# Altium project firesys.PrjPcb (part 1 of 2)
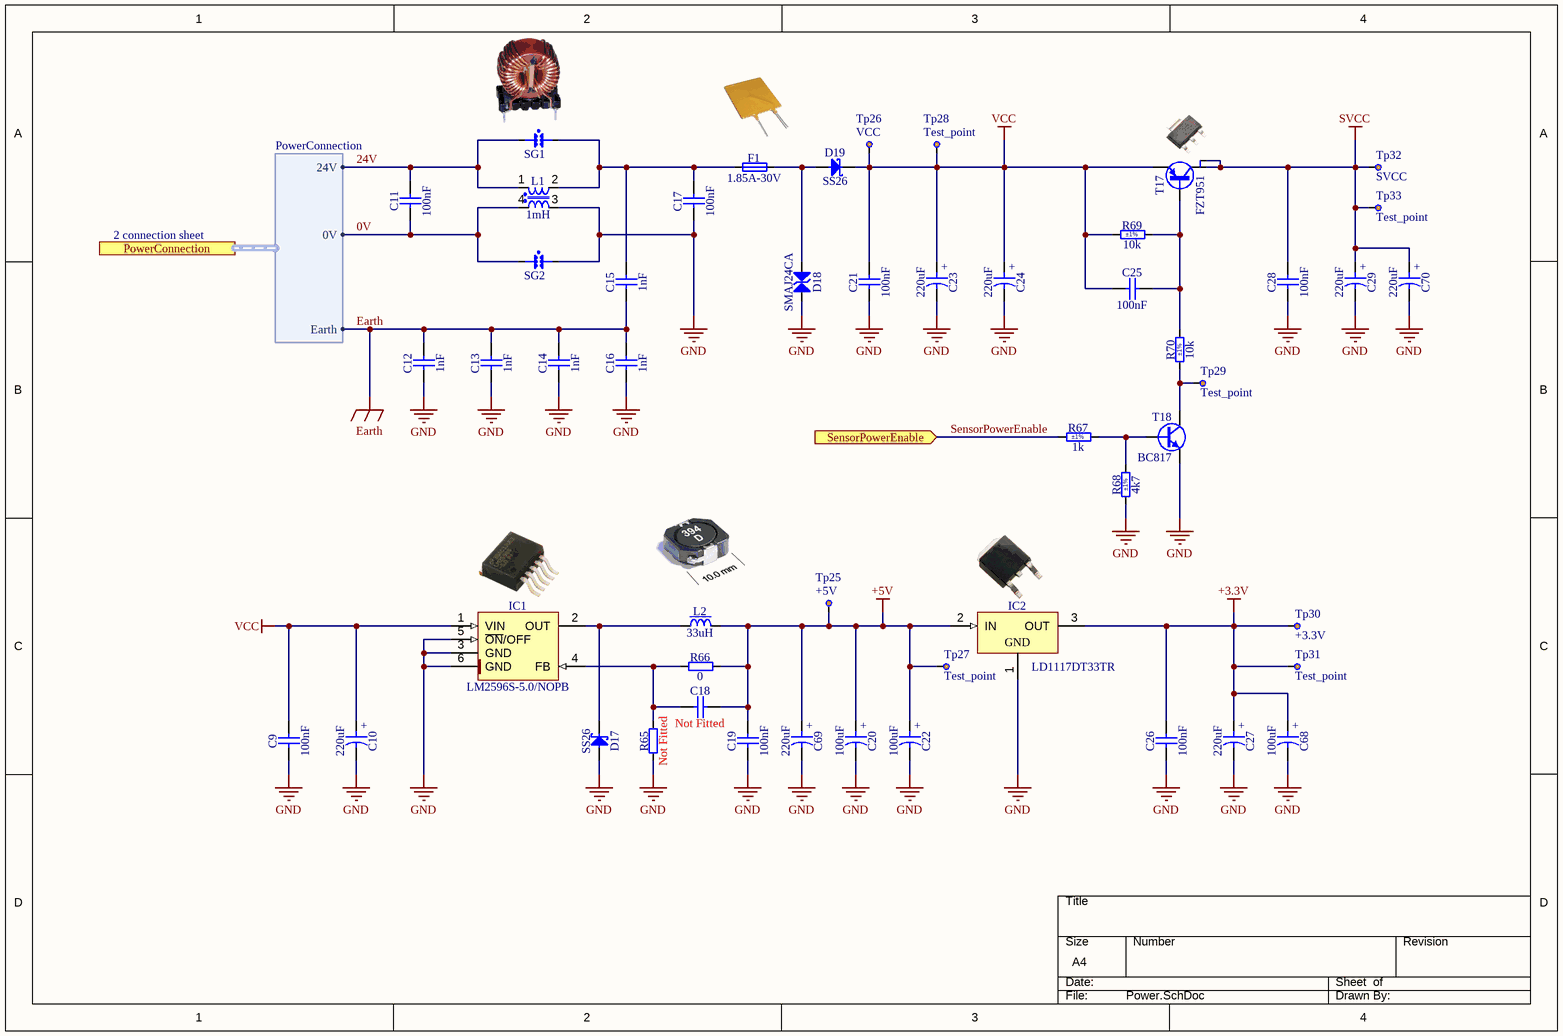
[diagram p0: Power.SchDoc]
10 sheets, 380 parts. Net scope: flat (ports and power ports of the same name join across sheets).
Board file: PCB1.PcbDoc
Sheets:
  Power.SchDoc
  Sensing.SchDoc
  FlashMemory.SchDoc
  mcu.SchDoc
  ShiftRegister.SchDoc
  Sound.SchDoc
  Interface.SchDoc
  Optocoupler.SchDoc
  Button.SchDoc
  Relay.SchDoc

## Sheet Power.SchDoc
size A4; SheetNumber: 2; SheetTotal: 11

### Parts
C9  100nF  [CAPC3216X140N]
C10  220uF  [CAPAE830X1020N]
C11  100nF  [CAPC3216X140N]
C12  1nF  [CAPC3216X94N]
C13  1nF  [CAPC3216X94N]
C14  1nF  [CAPC3216X94N]
C15  1nF  [CAPC3216X94N]
C16  1nF  [CAPC3216X94N]
C17  100nF  [CAPC3216X140N]
C18  Not Fitted  [CAPC2012X135N]
C19  100nF  [CAPC1608X87N]
C20  100uF  [CAPMP6032X280N]
C21  100nF  [CAPC3216X140N]
C22  100uF  [CAPMP6032X280N]
C23  220uF  [CAPAE830X1020N]
C24  220uF  [CAPAE830X1020N]
C25  100nF  [CAPC3216X140N]
C26  100nF  [CAPC1608X87N]
C27  220uF  [CAPAE830X1020N]
C28  100nF  [CAPC3216X140N]
C29  220uF  [CAPAE830X1020N]
C68  100uF  [CAPMP6032X280N]
C69  220uF  [CAPAE830X1020N]
C70  220uF  [CAPAE830X1020N]
D17  SS26  [DIOM5336X265N]
D18  SMAJ24CA  [DIOM5226X262N]
D19  SS26  [DIOM5336X265N]
F1  1.85A-30V  [FUSR_LITTELFUSE_RUEF185]
IC1  LM2596S-5.0/NOPB  [TO170P1435X465-6N-R1041X635]
IC2  LD1117DT33TR  [TO228P972X240-3N-R540X510]
L1  1mH  [IND_WURTH_WE-CMB-XS]
L2  33uH  [IND_COILCRAFT_MSS1038]
R65  Not Fitted  [RESC2012X60N]
R66  0  [RESC1608X55N]
R67  1k  Tolerance: ±1%  [RESC1608X55N]
R68  4k7  Tolerance: ±1%  [RESC1608X55N]
R69  10k  Tolerance: ±1%  [RESC3216X65N]
R70  10k  Tolerance: ±1%  [RESC3216X65N]
SG1  Spark Gap  [PCB_SPARK_GAP]  (value not drawn)
SG2  Spark Gap  [PCB_SPARK_GAP]  (value not drawn)
T17  FZT951  [SOT230P700X180-4N]
T18  BC817  [SOT95P230X110-3N]
Tp25  +5V  [TP_C40]
Tp26  VCC  [TP_C40]
Tp27  Test_point  [TP_C40]
Tp28  Test_point  [TP_C40]
Tp29  Test_point  [TP_C40]
Tp30  +3.3V  [TP_C40]
Tp31  Test_point  [TP_C40]
Tp32  SVCC  [TP_C40]
Tp33  Test_point  [TP_C40]

### Ports
PowerConnection (harness PowerConnection), SensorPowerEnable (in)

### Harnesses
PowerConnection: 24V, 0V, Earth

### Nets
+3.3V: C26.2 C27.1 C68.1 IC2.3(OUT) Tp30.1 Tp31.1
+5V: C18.2 C19.2 C20.1 C22.1 C69.1 IC2.2(IN) L2.2 R66.2 Tp25.1 Tp27.1
Earth: C12.2 C13.2 C14.2 C15.1 C16.2 ; port PowerConnection.Earth
GND: C9.1 C10.2 C12.1 C13.1 C14.1 C16.1 C17.1 C19.1 C20.2 C21.1 C22.2 C23.2 C24.2 C26.1 C27.2 C28.1 C29.2 C68.2 C69.2 C70.2 D17.2(A) D18.2 IC1.3(GND) IC1.5(~{ON}/OFF) IC1.6(GND) IC2.1(GND) L1.3 R65.1 R68.1 SG2.2 T18.2(E)
SVCC: C28.2 C29.1 C70.1 T17.2(C) T17.4(C) Tp32.1 Tp33.1
VCC: C9.2 C10.1 C21.2 C23.1 C24.1 C25.1 D19.1(C) IC1.1(VIN) R69.1 T17.3(E) Tp26.1 Tp28.1
0V: C11.1 L1.4 SG2.1 ; port PowerConnection.0V
24V: C11.2 L1.1 SG1.1 ; port PowerConnection.24V
SensorPowerEnable: R67.1 ; port SensorPowerEnable
NetC15_2: C15.2 C17.2 F1.1 L1.2 SG1.2
NetC18_1: C18.1 IC1.4(FB) R65.2 R66.1
NetC25_2: C25.2 R69.2 R70.2 T17.1(B)
NetD17_1: D17.1(C) IC1.2(OUT) L2.1
NetD18_1: D18.1 D19.2(A) F1.2
NetR67_2: R67.2 R68.2 T18.1(B)
NetR70_1: R70.1 T18.3(C) Tp29.1

### Notes on the sheet
- 2 connection sheet
- THIS DOCUMENT AND THE DATA DISCLOSED HEREIN OR
- HEREWITH IS THE PROPERTY OF ALTIUM LIMITED AND MAY
- DWG NO:
- REVISION
- REV:
- DESCRIPTION
- DATE
- APPROVED
- BE FREELY DISTRIBUTED IN WHOLE. NO RIGHTS ARE
- RESERVED OR EXPRESS OR IMPLIED WARANTEE GIVEN.
- ENG:
- APPROVALS
- PROJECT
- DSN:
- CHK:
- REFERENCE DOCUMENTS
- PROJECT REVISION:
- TITLE
- DOCUMENT REVISION:
- DESIGN ITEM:
- BOM:
- FAB DWG:
- PCB DWG:
- ASSY DWG:
- SCALE:
- A3
- SIZE
- CAGE CODE
- FILE NAME
- DWG NO.
- SHEET
- OF
- REV
- (in symbol CAE830-1020_220UF_50V_20%) +
- (in symbol CTE6032-28_100UF_16V_10%) +

### Library data of the parts
C9 C11 C17 C21 C25 C28 = CC1206_100NF_100V_10%_X7R: Non-polarised capacitor; Part Description: SMD Multilayer Chip Ceramic Capacitor; Manufacturer: GENERIC; Manufacturer1 Part Number: 222260115649; Voltage: 100V; TC: X7R; Tolerance: ±10%; Part Number: CC1206_100NF_100V_10%_X7R; Component Kind: Standard; Component Type: Standard; Pin Count: 2; Value: 100nF; Status: Preferred; Manufacturer Part Number: CC1206_100NF_100V_10%_X7R; Case: 1206; Mounted: Yes; Socket: No; SMD: Yes; Sense: No; Manufacturer1 Example: PHYCOMP; Manufacturer1 ComponentHeight: 1.25mm; HelpURL: \\cern.ch\dfs\Applications\Altium\Datasheets\CC1206_X7R_PHYCOMP.pdf; Author: CERN DEM JLC; CreateDate: 24.08.2009; LatestRevisionDate: 24.08.2009
C10 C23 C24 C27 C29 C69 C70 = CAE830-1020_220UF_50V_20%: Polarised capacitor; Part Description: Aluminum Electrolytic SMT Capacitor; Manufacturer: PANASONIC; Manufacturer Part Number: EEEFT1H221AP; Voltage: 50V; Tolerance: ±20%; Part Number: CAE830-1020_220UF_50V_20%; Component Kind: Standard; Component Type: Standard; Pin Count: 2; Value: 220uF; Status: Not Recommended; Case: F; Mounted: Yes; Socket: No; SMD: Yes; Sense: No; ComponentHeight: 10.2mm; HelpURL: \\cern.ch\dfs\Applications\Altium\Datasheets\CAE_PANASONIC_FT.pdf; Author: CERN DEM BC; CreateDate: 12.04.2021; LatestRevisionDate: 12.04.2021
C12-C16 = CC1206_1NF_200V_10%_X7R: Non-polarised capacitor; Part Description: SMD Multilayer Chip Ceramic Capacitor; Manufacturer: GENERIC; Manufacturer1 Part Number: 12062C102KAT2A; Voltage: 200V; TC: X7R; Tolerance: ±10%; Part Number: CC1206_1NF_200V_10%_X7R; Component Kind: Standard; Component Type: Standard; Pin Count: 2; Value: 1nF; Status: None; Manufacturer Part Number: CC1206_1NF_200V_10%_X7R; Case: 1206; Mounted: Yes; Socket: No; SMD: Yes; Sense: No; Manufacturer1 Example: AVX; Manufacturer1 ComponentHeight: 0.94mm; HelpURL: \\cern.ch\dfs\Applications\Altium\Datasheets\CC1206_X7R_AVX.pdf; Author: CERN DEM JLC; CreateDate: 05.03.2015; LatestRevisionDate: 05.03.2015
C18 = CC0805_NO-VALUE: Non-polarised capacitor; Part Description: Reserved Footprint For 0805(2012) Chip Ceramic Capacitor; Value: Undefined; Mounted: No; Part Number: CC0805_NO-VALUE; Component Kind: Standard; Component Type: Standard; Pin Count: 2; Status: None; Manufacturer: Undefined; Manufacturer Part Number: CC0805_NO-VALUE; Case: 0805; Socket: No; SMD: Yes; Sense: No; Manufacturer1 ComponentHeight: 1.35mm; HelpURL: Undefined; Author: CERN DEM JLC; CreateDate: 10.12.2008; LatestRevisionDate: 11.09.2013
C19 C26 = CC0603_100NF_50V_10%_X7R: Non-polarised capacitor; Part Description: SMD Multilayer Chip Ceramic Capacitor; Manufacturer: GENERIC; Manufacturer1 Part Number: 223858615649; Voltage: 50V; TC: X7R; Tolerance: ±10%; Part Number: CC0603_100NF_50V_10%_X7R; Component Kind: Standard; Component Type: Standard; Pin Count: 2; Value: 100nF; Status: Preferred; Manufacturer Part Number: CC0603_100NF_50V_10%_X7R; Case: 0603; Mounted: Yes; Socket: No; SMD: Yes; Sense: No; Manufacturer1 Example: PHYCOMP; Manufacturer1 ComponentHeight: 0.87mm; HelpURL: \\cern.ch\dfs\Applications\Altium\Datasheets\CC0603_X7R_PHYCOMP.pdf; Author: CERN DEM JLC; CreateDate: 03.12.2007; LatestRevisionDate: 03.12.2007
C20 C22 C68 = CTE6032-28_100UF_16V_10%: Polarised capacitor; Part Description: Solid Tantalum Chip Capacitor; Manufacturer: GENERIC; Manufacturer1 Part Number: TAJC107K016RNJ; Voltage: 16V; Tolerance: ±10%; Part Number: CTE6032-28_100UF_16V_10%; Component Kind: Standard; Component Type: Standard; Pin Count: 2; Value: 100uF; Status: Preferred; Manufacturer Part Number: CTE6032-28_100UF_16V_10%; Case: C; Mounted: Yes; Socket: No; SMD: Yes; Sense: No; Manufacturer1 Example: AVX; Manufacturer1 ComponentHeight: 2.8mm; HelpURL: \\cern.ch\dfs\Applications\Altium\Datasheets\CTE_AVX_TAJ.pdf; Author: CERN DEM JLC; CreateDate: 16.12.2013; LatestRevisionDate: 14.04.2021
D17 D19 = SS26: Schottky Diode; Part Description: Schottky Rectifier; Manufacturer: FAIRCHILD SEMICONDUCTOR; Voltage: 60V; Power: 2A; PressFit: No; Bonding: No; Part Number: SS26; Component Kind: Standard; Component Type: Standard; Device: SS26; PackageDescription: DO-214-AA/SMB Diode, Molded Body; 5.34mm L X 3.625mm W X 2.65mm H, IPC Medium Density; Manufacturer Part Number: SS26; Pin Count: 2; Case: DO-214AA; Mounted: Yes; Socket: No; SMD: Yes; Sense: No; ComponentHeight: 2.65mm; HelpURL: \\cern.ch\dfs\Applications\Altium\Datasheets\SS26.pdf; Author: CERN DEM JMW; CreateDate: 10.07.2015; LatestRevisionDate: 10.07.2015
D18 = SMAJ24CA: Transient Voltage Suppressor Diode (Bi-Directional); Part Description: Surface Mount Bi-directional Transient Voltage Suppressor Diode; Manufacturer: BOURNS; Voltage: 24V; Power: 400W; PressFit: No; Bonding: No; Part Number: SMAJ24CA; Component Kind: Standard; Component Type: Standard; Device: SMAJ24CA; PackageDescription: DO-214-AC/SMA Diode, Molded Body; 5.21mm L X 2.605mm W X 2.62mm H, IPC Medium Density; Manufacturer Part Number: SMAJ24CA; Pin Count: 2; Case: DO-214AC; Mounted: Yes; Socket: No; SMD: Yes; Sense: No; ComponentHeight: 2.62mm; HelpURL: \\cern.ch\dfs\Applications\Altium\Datasheets\SMAJ24CA.pdf; Author: CERN DEM JLC; CreateDate: 06.07.2011; LatestRevisionDate: 06.07.2011
F1 = FUSR_LITTELFUSE_RUEF185: Fuse; Part Description: Radial-Leaded PolySwitch® PPTC Resettable Fuse; PressFit: No; Part Number: FUSR_LITTELFUSE_RUEF185; Component Kind: Standard; Component Type: Standard; Pin Count: 2; PackageDescription: Radial-Leaded PolySwitch® PPTC Resettable Fuse, Body 10.2 x 3.00mm, RUEF Series; Family: Fuses Resettable; Mounted: Yes; Socket: No; SMD: No; Sense: No; Value: 1.85A-30V; Manufacturer: LITTELFUSE; Manufacturer Part Number: RUEF185; ComponentHeight: 15.7mm; HelpURL: \\cern.ch\dfs\Applications\Altium\Datasheets\FUSR_LITTELFUSE_RUEF.pdf; Author: CERN DEM BC; CreateDate: 09.04.2021; LatestRevisionDate: 09.04.2021
IC1 = LM2596S-5.0/NOPB: SIMPLE SWITCHER® Power Converter 150kHz, 3A Step-Down Voltage Regulator; Part Description: 4.5V to 40V Input to 5V Output, SIMPLE SWITCHER® Power Converter 150kHz, 3A Step-Down Voltage Regulator; Manufacturer: TEXAS INSTRUMENTS; PressFit: No; Bonding: No; Part Number: LM2596S-5.0/NOPB; Component Kind: Standard; Component Type: Standard; Device: LM2596S-5.0/NOPB; PackageDescription: D2PAK TO-263, TO, 1.70mm Pitch; 5 Pin, 14.35mm L X 8.64mm W X 4.65mm H body IPC Medium Density; Manufacturer Part Number: LM2596S-5.0/NOPB; Pin Count: 6; Case: TO-263-5; Mounted: Yes; Socket: No; SMD: Yes; Sense: No; ComponentHeight: 4.65mm; HelpURL: \\cern.ch\dfs\Applications\Altium\Datasheets\LM2596S-5.0-NOPB.pdf; Author: CERN DEM JLC; CreateDate: 19.12.2018; LatestRevisionDate: 19.12.2018
IC2 = LD1117DT33TR: 3-Terminal Regulator 1=GND 2=IN 3=OUT; Part Description: 3.3V 800mA Low drop fixed and adjustable positive voltage regulators; Manufacturer: ST MICROELECTRONICS; PressFit: No; Bonding: No; Part Number: LD1117DT33TR; Component Kind: Standard; Component Type: Standard; Device: LD1117DT33TR; PackageDescription: TO-252 DPAK TO, 2.28mm Pitch; 2 Pin, 9.725mm L X 6.10mm W X 2.40mm H body, IPC Medium Density; Manufacturer Part Number: LD1117DT33TR; Pin Count: 3; Case: DPAK; Mounted: Yes; Socket: No; SMD: Yes; Sense: No; ComponentHeight: 2.4mm; HelpURL: \\cern.ch\dfs\Applications\Altium\Datasheets\LD1117DT33TR.pdf; Author: CERN DEM JLC; CreateDate: 02.09.2009; LatestRevisionDate: 21.09.2009
L1 = IND_1MH_30%_WURTH_WE-CMB-XS: Inductor Common Mode; Part Description: Common Mode Power Choke WE-CMB Series Type XS; Manufacturer: WURTH ELEKTRONIK; Manufacturer Part Number: 744821201; Power: 2A; Resistance: 0.045R; Tolerance: ±30%; Part Number: IND_1MH_30%_WURTH_WE-CMB-XS; Component Kind: Standard; Component Type: Standard; Pin Count: 4; Value: 1mH; Mounted: Yes; Socket: No; SMD: No; Sense: No; ComponentHeight: 18mm; HelpURL: \\cern.ch\dfs\Applications\Altium\Datasheets\IND_WURTH_WE-CMB_744821201.pdf; Author: CERN DEM JLC; CreateDate: 03.09.2012; LatestRevisionDate: 03.09.2012
L2 = IND_33UH_20%_COILCRAFT_MSS1038: Inductor With Core; Part Description: SMT Power Inductor; Manufacturer Part Number: MSS1038-333ML; Power: 1.6A; Resistance: 0.093R; Tolerance: ±20%; Part Number: IND_33UH_20%_COILCRAFT_MSS1038; Component Kind: Standard; Component Type: Standard; Pin Count: 2; Value: 33uH; Manufacturer: COILCRAFT; Mounted: Yes; Socket: No; SMD: Yes; Sense: No; ComponentHeight: 4.0mm; HelpURL: \\cern.ch\dfs\Applications\Altium\Datasheets\IND_COILCRAFT_MSS1038.pdf; Author: CERN DEM JLC; CreateDate: 09.12.2009; LatestRevisionDate: 09.12.2009
R65 = R0805_NO-VALUE: Resistor; Part Description: Reserved Footprint For a 0805 (2012) Chip Resistor; Value: Undefined; PressFit: No; Mounted: No; Part Number: R0805_NO-VALUE; Component Kind: Standard; Component Type: Standard; Pin Count: 2; Status: None; Manufacturer: Undefined; Manufacturer Part Number: R0805_NO-VALUE; Case: 0805; Sense: No; Socket: No; SMD: Yes; Manufacturer1 Example: Undefined; Manufacturer1 Part Number: Undefined; Manufacturer1 ComponentHeight: Undefined; HelpURL: Undefined; Author: CERN DEM JLC; CreateDate: 03.12.2007; LatestRevisionDate: 13.03.2008
R66 = R0603_0R_JUMPER: Resistor; Part Description: 1A (0.05R Max DC Resistance) Zero Ohm Jumper; Manufacturer: GENERIC; Manufacturer1 Part Number: NRC06Z0; PressFit: No; Part Number: R0603_0R_JUMPER; Component Kind: Standard; Component Type: Standard; Pin Count: 2; Value: 0; Status: Preferred; Manufacturer Part Number: R0603_0R_JUMPER; Case: 0603; Mounted: Yes; Sense: No; Socket: No; SMD: Yes; Manufacturer1 Example: NIC COMPONENT; Manufacturer1 ComponentHeight: 0.55mm; HelpURL: \\cern.ch\dfs\Applications\Altium\Datasheets\R0603_NIC_NRC.pdf; Author: CERN DEM JLC; CreateDate: 03.12.2007; LatestRevisionDate: 13.03.2008
R67 = R0603_1K_1%_0.1W_100PPM: Resistor - 1%; Part Description: General Purpose Thick Film Chip Resistor; Manufacturer: GENERIC; Manufacturer1 Part Number: NRC06F1001TRF; Power: 0.1W; TC: ±100ppm/°C; PressFit: No; Part Number: R0603_1K_1%_0.1W_100PPM; Component Kind: Standard; Component Type: Standard; Pin Count: 2; Value: 1k; Status: Preferred; Manufacturer Part Number: R0603_1K_1%_0.1W_100PPM; Case: 0603; Mounted: Yes; Sense: No; Socket: No; SMD: Yes; Manufacturer1 Example: NIC COMPONENT; Manufacturer1 ComponentHeight: 0.55mm; HelpURL: \\cern.ch\dfs\Applications\Altium\Datasheets\R0603_NIC_NRC.pdf; Author: CERN DEM JLC; CreateDate: 03.12.2007; LatestRevisionDate: 13.03.2008
R68 = R0603_4K7_1%_0.1W_100PPM: Resistor - 1%; Part Description: General Purpose Thick Film Chip Resistor; Manufacturer: GENERIC; Manufacturer1 Part Number: NRC06F4701TRF; Power: 0.1W; TC: ±100ppm/°C; PressFit: No; Part Number: R0603_4K7_1%_0.1W_100PPM; Component Kind: Standard; Component Type: Standard; Pin Count: 2; Value: 4k7; Status: Preferred; Manufacturer Part Number: R0603_4K7_1%_0.1W_100PPM; Case: 0603; Mounted: Yes; Sense: No; Socket: No; SMD: Yes; Manufacturer1 Example: NIC COMPONENT; Manufacturer1 ComponentHeight: 0.55mm; HelpURL: \\cern.ch\dfs\Applications\Altium\Datasheets\R0603_NIC_NRC.pdf; Author: CERN DEM JLC; CreateDate: 03.12.2007; LatestRevisionDate: 13.03.2008
R69 R70 = R1206_10K_1%_0.25W_100PPM: Resistor - 1%; Part Description: General Purpose Thick Film Chip Resistor; Manufacturer: GENERIC; Manufacturer1 Part Number: NRC12F1002TRF; Power: 0.25W; TC: ±100ppm/°C; PressFit: No; Part Number: R1206_10K_1%_0.25W_100PPM; Component Kind: Standard; Component Type: Standard; Pin Count: 2; Value: 10k; Status: Preferred; Manufacturer Part Number: R1206_10K_1%_0.25W_100PPM; Case: 1206; Mounted: Yes; Sense: No; Socket: No; SMD: Yes; Manufacturer1 Example: NIC COMPONENT; Manufacturer1 ComponentHeight: 0.65mm; HelpURL: \\cern.ch\dfs\Applications\Altium\Datasheets\R1206_NIC_NRC.pdf; Author: CERN DEM JLC; CreateDate: 03.12.2007; LatestRevisionDate: 13.03.2008
SG1 SG2 = SparkGap: PCB Spark Gap
T17 = FZT951: PNP Transistor; Part Description: 60V 5A PNP Silicon Planar High Current Transistor; Manufacturer: ZETEX SEMICONDUCTORS; PressFit: No; Bonding: No; Part Number: FZT951; Component Kind: Standard; Component Type: Standard; Device: FZT951; PackageDescription: SOT223, 2.30mm Pitch; 4 Pin, 3.70mm W X 6.70mm L X 1.80mm H body, IPC Medium Density; Manufacturer Part Number: FZT951; Pin Count: 4; Case: SOT223; Mounted: Yes; Socket: No; SMD: Yes; Sense: No; ComponentHeight: 1.8mm; HelpURL: \\cern.ch\dfs\Applications\Altium\Datasheets\FZT951.pdf; Author: CERN DEM JLC; CreateDate: 16.07.2008; LatestRevisionDate: 16.07.2008
T18 = BC817: NPN Transistor; Part Description: 45V 500mA NPN General-Purpose Transistor; Manufacturer: NXP SEMICONDUCTORS; PressFit: No; Bonding: No; Part Number: BC817; Component Kind: Standard; Component Type: Standard; Device: BC817; PackageDescription: SOT23, 0.95mm Pitch; 3 Pin, 1.30mm W X 2.90mm L X 1.10mm H body, IPC Medium Density; Manufacturer Part Number: BC817; Pin Count: 3; Case: SOT23-3; Mounted: Yes; Socket: No; SMD: Yes; Sense: No; ComponentHeight: 1.1mm; HelpURL: \\cern.ch\dfs\Applications\Altium\Datasheets\BC817.pdf; Author: CERN DEM JLC; CreateDate: 12.05.2011; LatestRevisionDate: 12.05.2011
Tp25-Tp33 = Test point: Published: 8-Jun-2000; LatestRevisionDate: 17-Jul-2002; LatestRevisionNote: Re-released for DXP Platform.; PackageReference: AXIAL-0.3; Publisher: Altium Limited

## Sheet Sensing.SchDoc
size A3; SheetNumber: 3; SheetTotal: 11
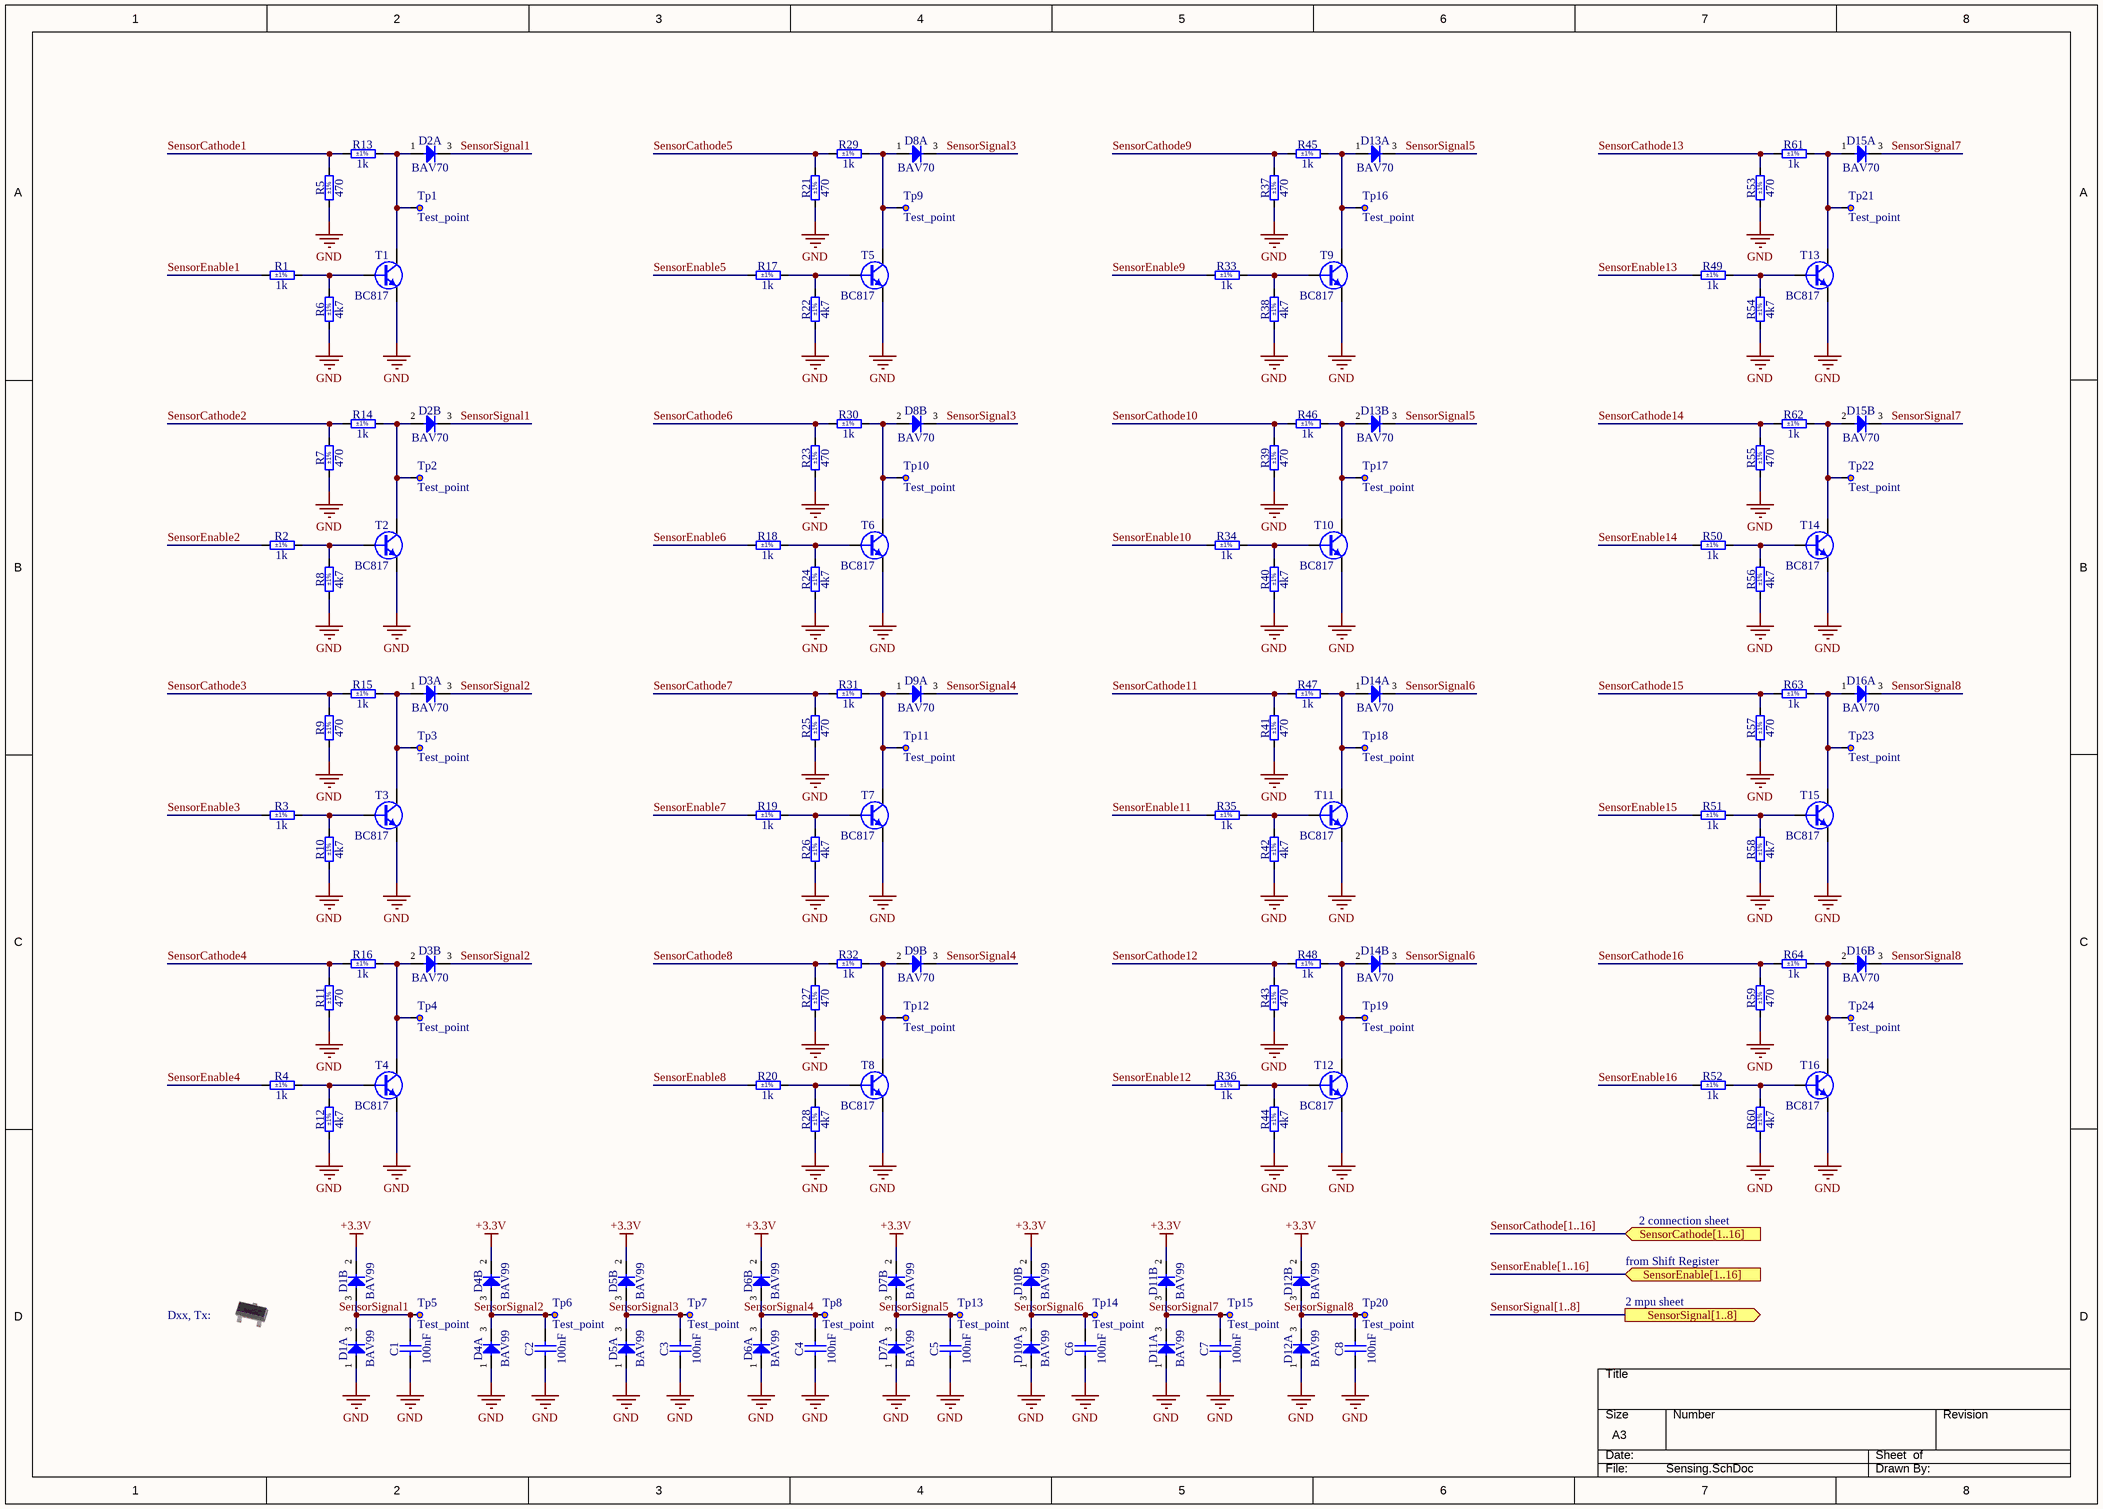
[diagram p1: Sensing.SchDoc]

### Parts
C1  100nF  [CAPC1608X87N]
C2  100nF  [CAPC1608X87N]
C3  100nF  [CAPC1608X87N]
C4  100nF  [CAPC1608X87N]
C5  100nF  [CAPC1608X87N]
C6  100nF  [CAPC1608X87N]
C7  100nF  [CAPC1608X87N]
C8  100nF  [CAPC1608X87N]
D1  BAV99  [SOT95P240X110-3N]  (parts A,B of 2)
D2  BAV70  [SOT95P240X110-3N]  (parts A,B of 2)
D3  BAV70  [SOT95P240X110-3N]  (parts A,B of 2)
D4  BAV99  [SOT95P240X110-3N]  (parts A,B of 2)
D5  BAV99  [SOT95P240X110-3N]  (parts A,B of 2)
D6  BAV99  [SOT95P240X110-3N]  (parts A,B of 2)
D7  BAV99  [SOT95P240X110-3N]  (parts A,B of 2)
D8  BAV70  [SOT95P240X110-3N]  (parts A,B of 2)
D9  BAV70  [SOT95P240X110-3N]  (parts A,B of 2)
D10  BAV99  [SOT95P240X110-3N]  (parts A,B of 2)
D11  BAV99  [SOT95P240X110-3N]  (parts A,B of 2)
D12  BAV99  [SOT95P240X110-3N]  (parts A,B of 2)
D13  BAV70  [SOT95P240X110-3N]  (parts A,B of 2)
D14  BAV70  [SOT95P240X110-3N]  (parts A,B of 2)
D15  BAV70  [SOT95P240X110-3N]  (parts A,B of 2)
D16  BAV70  [SOT95P240X110-3N]  (parts A,B of 2)
R1  1k  Tolerance: ±1%  [RESC1608X55N]
R2  1k  Tolerance: ±1%  [RESC1608X55N]
R3  1k  Tolerance: ±1%  [RESC1608X55N]
R4  1k  Tolerance: ±1%  [RESC1608X55N]
R5  470  Tolerance: ±1%  [RESC6331X70N]
R6  4k7  Tolerance: ±1%  [RESC1608X55N]
R7  470  Tolerance: ±1%  [RESC6331X70N]
R8  4k7  Tolerance: ±1%  [RESC1608X55N]
R9  470  Tolerance: ±1%  [RESC6331X70N]
R10  4k7  Tolerance: ±1%  [RESC1608X55N]
R11  470  Tolerance: ±1%  [RESC6331X70N]
R12  4k7  Tolerance: ±1%  [RESC1608X55N]
R13  1k  Tolerance: ±1%  [RESC1608X55N]
R14  1k  Tolerance: ±1%  [RESC1608X55N]
R15  1k  Tolerance: ±1%  [RESC1608X55N]
R16  1k  Tolerance: ±1%  [RESC1608X55N]
R17  1k  Tolerance: ±1%  [RESC1608X55N]
R18  1k  Tolerance: ±1%  [RESC1608X55N]
R19  1k  Tolerance: ±1%  [RESC1608X55N]
R20  1k  Tolerance: ±1%  [RESC1608X55N]
R21  470  Tolerance: ±1%  [RESC6331X70N]
R22  4k7  Tolerance: ±1%  [RESC1608X55N]
R23  470  Tolerance: ±1%  [RESC6331X70N]
R24  4k7  Tolerance: ±1%  [RESC1608X55N]
R25  470  Tolerance: ±1%  [RESC6331X70N]
R26  4k7  Tolerance: ±1%  [RESC1608X55N]
R27  470  Tolerance: ±1%  [RESC6331X70N]
R28  4k7  Tolerance: ±1%  [RESC1608X55N]
R29  1k  Tolerance: ±1%  [RESC1608X55N]
R30  1k  Tolerance: ±1%  [RESC1608X55N]
R31  1k  Tolerance: ±1%  [RESC1608X55N]
R32  1k  Tolerance: ±1%  [RESC1608X55N]
R33  1k  Tolerance: ±1%  [RESC1608X55N]
R34  1k  Tolerance: ±1%  [RESC1608X55N]
R35  1k  Tolerance: ±1%  [RESC1608X55N]
R36  1k  Tolerance: ±1%  [RESC1608X55N]
R37  470  Tolerance: ±1%  [RESC6331X70N]
R38  4k7  Tolerance: ±1%  [RESC1608X55N]
R39  470  Tolerance: ±1%  [RESC6331X70N]
R40  4k7  Tolerance: ±1%  [RESC1608X55N]
R41  470  Tolerance: ±1%  [RESC6331X70N]
R42  4k7  Tolerance: ±1%  [RESC1608X55N]
R43  470  Tolerance: ±1%  [RESC6331X70N]
R44  4k7  Tolerance: ±1%  [RESC1608X55N]
R45  1k  Tolerance: ±1%  [RESC1608X55N]
R46  1k  Tolerance: ±1%  [RESC1608X55N]
R47  1k  Tolerance: ±1%  [RESC1608X55N]
R48  1k  Tolerance: ±1%  [RESC1608X55N]
R49  1k  Tolerance: ±1%  [RESC1608X55N]
R50  1k  Tolerance: ±1%  [RESC1608X55N]
R51  1k  Tolerance: ±1%  [RESC1608X55N]
R52  1k  Tolerance: ±1%  [RESC1608X55N]
R53  470  Tolerance: ±1%  [RESC6331X70N]
R54  4k7  Tolerance: ±1%  [RESC1608X55N]
R55  470  Tolerance: ±1%  [RESC6331X70N]
R56  4k7  Tolerance: ±1%  [RESC1608X55N]
R57  470  Tolerance: ±1%  [RESC6331X70N]
R58  4k7  Tolerance: ±1%  [RESC1608X55N]
R59  470  Tolerance: ±1%  [RESC6331X70N]
R60  4k7  Tolerance: ±1%  [RESC1608X55N]
R61  1k  Tolerance: ±1%  [RESC1608X55N]
R62  1k  Tolerance: ±1%  [RESC1608X55N]
R63  1k  Tolerance: ±1%  [RESC1608X55N]
R64  1k  Tolerance: ±1%  [RESC1608X55N]
T1  BC817  [SOT95P230X110-3N]
T2  BC817  [SOT95P230X110-3N]
T3  BC817  [SOT95P230X110-3N]
T4  BC817  [SOT95P230X110-3N]
T5  BC817  [SOT95P230X110-3N]
T6  BC817  [SOT95P230X110-3N]
T7  BC817  [SOT95P230X110-3N]
T8  BC817  [SOT95P230X110-3N]
T9  BC817  [SOT95P230X110-3N]
T10  BC817  [SOT95P230X110-3N]
T11  BC817  [SOT95P230X110-3N]
T12  BC817  [SOT95P230X110-3N]
T13  BC817  [SOT95P230X110-3N]
T14  BC817  [SOT95P230X110-3N]
T15  BC817  [SOT95P230X110-3N]
T16  BC817  [SOT95P230X110-3N]
Tp1  Test_point  [TP_C40]
Tp2  Test_point  [TP_C40]
Tp3  Test_point  [TP_C40]
Tp4  Test_point  [TP_C40]
Tp5  Test_point  [TP_C40]
Tp6  Test_point  [TP_C40]
Tp7  Test_point  [TP_C40]
Tp8  Test_point  [TP_C40]
Tp9  Test_point  [TP_C40]
Tp10  Test_point  [TP_C40]
Tp11  Test_point  [TP_C40]
Tp12  Test_point  [TP_C40]
Tp13  Test_point  [TP_C40]
Tp14  Test_point  [TP_C40]
Tp15  Test_point  [TP_C40]
Tp16  Test_point  [TP_C40]
Tp17  Test_point  [TP_C40]
Tp18  Test_point  [TP_C40]
Tp19  Test_point  [TP_C40]
Tp20  Test_point  [TP_C40]
Tp21  Test_point  [TP_C40]
Tp22  Test_point  [TP_C40]
Tp23  Test_point  [TP_C40]
Tp24  Test_point  [TP_C40]

### Ports
SensorCathode[1..16] (in), SensorEnable[1..16] (in), SensorSignal[1..8] (out)

### Nets
+3.3V: D1.2(C) D4.2(C) D5.2(C) D6.2(C) D7.2(C) D10.2(C) D11.2(C) D12.2(C)
GND: C1.1 C2.1 C3.1 C4.1 C5.1 C6.1 C7.1 C8.1 D1.1(A) D4.1(A) D5.1(A) D6.1(A) D7.1(A) D10.1(A) D11.1(A) D12.1(A) R5.1 R6.1 R7.1 R8.1 R9.1 R10.1 R11.1 R12.1 R21.1 R22.1 R23.1 R24.1 R25.1 R26.1 R27.1 R28.1 R37.1 R38.1 R39.1 R40.1 R41.1 R42.1 R43.1 R44.1 R53.1 R54.1 R55.1 R56.1 R57.1 R58.1 R59.1 R60.1 T1.2(E) T2.2(E) T3.2(E) T4.2(E) T5.2(E) T6.2(E) T7.2(E) T8.2(E) T9.2(E) T10.2(E) T11.2(E) T12.2(E) T13.2(E) T14.2(E) T15.2(E) T16.2(E)
SensorCathode1: R5.2 R13.1
SensorCathode2: R7.2 R14.1
SensorCathode3: R9.2 R15.1
SensorCathode4: R11.2 R16.1
SensorCathode5: R21.2 R29.1
SensorCathode6: R23.2 R30.1
SensorCathode7: R25.2 R31.1
SensorCathode8: R27.2 R32.1
SensorCathode9: R37.2 R45.1
SensorCathode10: R39.2 R46.1
SensorCathode11: R41.2 R47.1
SensorCathode12: R43.2 R48.1
SensorCathode13: R53.2 R61.1
SensorCathode14: R55.2 R62.1
SensorCathode15: R57.2 R63.1
SensorCathode16: R59.2 R64.1
SensorEnable1: R1.1
SensorEnable2: R2.1
SensorEnable3: R3.1
SensorEnable4: R4.1
SensorEnable5: R17.1
SensorEnable6: R18.1
SensorEnable7: R19.1
SensorEnable8: R20.1
SensorEnable9: R33.1
SensorEnable10: R34.1
SensorEnable11: R35.1
SensorEnable12: R36.1
SensorEnable13: R49.1
SensorEnable14: R50.1
SensorEnable15: R51.1
SensorEnable16: R52.1
SensorSignal1: C1.2 D1.3(COMAC) D2.3(COMC) Tp5.1
SensorSignal2: C2.2 D3.3(COMC) D4.3(COMAC) Tp6.1
SensorSignal3: C3.2 D5.3(COMAC) D8.3(COMC) Tp7.1
SensorSignal4: C4.2 D6.3(COMAC) D9.3(COMC) Tp8.1
SensorSignal5: C5.2 D7.3(COMAC) D13.3(COMC) Tp13.1
SensorSignal6: C6.2 D10.3(COMAC) D14.3(COMC) Tp14.1
SensorSignal7: C7.2 D11.3(COMAC) D15.3(COMC) Tp15.1
SensorSignal8: C8.2 D12.3(COMAC) D16.3(COMC) Tp20.1
NetD2_1: D2.1(A) R13.2 T1.3(C) Tp1.1
NetD2_2: D2.2(A) R14.2 T2.3(C) Tp2.1
NetD3_1: D3.1(A) R15.2 T3.3(C) Tp3.1
NetD3_2: D3.2(A) R16.2 T4.3(C) Tp4.1
NetD8_1: D8.1(A) R29.2 T5.3(C) Tp9.1
NetD8_2: D8.2(A) R30.2 T6.3(C) Tp10.1
NetD9_1: D9.1(A) R31.2 T7.3(C) Tp11.1
NetD9_2: D9.2(A) R32.2 T8.3(C) Tp12.1
NetD13_1: D13.1(A) R45.2 T9.3(C) Tp16.1
NetD13_2: D13.2(A) R46.2 T10.3(C) Tp17.1
NetD14_1: D14.1(A) R47.2 T11.3(C) Tp18.1
NetD14_2: D14.2(A) R48.2 T12.3(C) Tp19.1
NetD15_1: D15.1(A) R61.2 T13.3(C) Tp21.1
NetD15_2: D15.2(A) R62.2 T14.3(C) Tp22.1
NetD16_1: D16.1(A) R63.2 T15.3(C) Tp23.1
NetD16_2: D16.2(A) R64.2 T16.3(C) Tp24.1
NetR1_2: R1.2 R6.2 T1.1(B)
NetR2_2: R2.2 R8.2 T2.1(B)
NetR3_2: R3.2 R10.2 T3.1(B)
NetR4_2: R4.2 R12.2 T4.1(B)
NetR17_2: R17.2 R22.2 T5.1(B)
NetR18_2: R18.2 R24.2 T6.1(B)
NetR19_2: R19.2 R26.2 T7.1(B)
NetR20_2: R20.2 R28.2 T8.1(B)
NetR33_2: R33.2 R38.2 T9.1(B)
NetR34_2: R34.2 R40.2 T10.1(B)
NetR35_2: R35.2 R42.2 T11.1(B)
NetR36_2: R36.2 R44.2 T12.1(B)
NetR49_2: R49.2 R54.2 T13.1(B)
NetR50_2: R50.2 R56.2 T14.1(B)
NetR51_2: R51.2 R58.2 T15.1(B)
NetR52_2: R52.2 R60.2 T16.1(B)

### Buses and harness runs
bus SensorCathode[1..16] = port SensorCathode[1..16]
bus SensorEnable[1..16] = port SensorEnable[1..16]
bus SensorSignal[1..8] = port SensorSignal[1..8]

### Notes on the sheet
- from Shift Register
- 2 connection sheet
- Dxx, Tx:
- 2 mpu sheet
- THIS DOCUMENT AND THE DATA DISCLOSED HEREIN OR
- HEREWITH IS THE PROPERTY OF ALTIUM LIMITED AND MAY
- DWG NO:
- REVISION
- REV:
- DESCRIPTION
- DATE
- APPROVED
- BE FREELY DISTRIBUTED IN WHOLE. NO RIGHTS ARE
- RESERVED OR EXPRESS OR IMPLIED WARANTEE GIVEN.
- ENG:
- APPROVALS
- PROJECT
- DSN:
- CHK:
- REFERENCE DOCUMENTS
- PROJECT REVISION:
- TITLE
- DOCUMENT REVISION:
- DESIGN ITEM:
- BOM:
- FAB DWG:
- PCB DWG:
- ASSY DWG:
- SCALE:
- A3
- SIZE
- CAGE CODE
- FILE NAME
- DWG NO.
- SHEET
- OF
- REV

### Library data of the parts
C1-C8 = CC0603_100NF_50V_10%_X7R: as C19 on sheet Power; Part Number: CC0603_100NF_50V_10%_X7R; Component Kind: Standard; Component Type: Standard; Pin Count: 2; Value: 100nF; Status: Preferred; Manufacturer Part Number: CC0603_100NF_50V_10%_X7R; Case: 0603; Mounted: Yes; Socket: No; SMD: Yes; Sense: No; Manufacturer1 Example: PHYCOMP; Manufacturer1 ComponentHeight: 0.87mm; HelpURL: \\cern.ch\dfs\Applications\Altium\Datasheets\CC0603_X7R_PHYCOMP.pdf; Author: CERN DEM JLC; CreateDate: 03.12.2007; LatestRevisionDate: 03.12.2007
D1 D4-D7 D10-D12 = BAV99: Serial Diode; Part Description: Dual Series Signal Diode; Manufacturer: FAIRCHILD SEMICONDUCTOR; Voltage: 70V; Power: 350mW; PressFit: No; Bonding: No; Part Number: BAV99; Component Kind: Standard; Component Type: Standard; Device: BAV99; PackageDescription: SOT, 0.95mm Pitch; 3 Pin, 1.40mm W X 3.00mm L X 1.10mm H body, IPC Medium Density; Manufacturer Part Number: BAV99; Pin Count: 3; Case: SOT23-3; Mounted: Yes; Socket: No; SMD: Yes; Sense: No; ComponentHeight: 1.1mm; HelpURL: \\cern.ch\dfs\Applications\Altium\Datasheets\BAV99.pdf; Author: CERN DEM JLC; CreateDate: 06.05.2008; LatestRevisionDate: 27.09.2012
D2 D3 D8 D9 D13-D16 = BAV70: Dual Common Cathode Diodes; Part Description: Dual Common Cathode High-Speed Switching Diodes; Manufacturer: NXP SEMICONDUCTORS; Voltage: 100V; PressFit: No; Bonding: No; Part Number: BAV70; Component Kind: Standard; Component Type: Standard; Device: BAV70; PackageDescription: SOT, 0.95mm Pitch; 3 Pin, 1.40mm W X 3.00mm L X 1.10mm H body, IPC Medium Density; Manufacturer Part Number: BAV70; Pin Count: 3; Case: SOT23-3; Mounted: Yes; Socket: No; SMD: Yes; Sense: No; ComponentHeight: 1.1mm; HelpURL: \\cern.ch\dfs\Applications\Altium\Datasheets\BAV70.pdf; Author: CERN DEM JLC; CreateDate: 05.06.2008; LatestRevisionDate: 05.06.2008
R1-R4 R13-R20 R29-R36 R45-R52 R61-R64 = R0603_1K_1%_0.1W_100PPM: as R67 on sheet Power; Part Number: R0603_1K_1%_0.1W_100PPM; Component Kind: Standard; Component Type: Standard; Pin Count: 2; Value: 1k; Status: Preferred; Manufacturer Part Number: R0603_1K_1%_0.1W_100PPM; Case: 0603; Mounted: Yes; Sense: No; Socket: No; SMD: Yes; Manufacturer1 Example: NIC COMPONENT; Manufacturer1 ComponentHeight: 0.55mm; HelpURL: \\cern.ch\dfs\Applications\Altium\Datasheets\R0603_NIC_NRC.pdf; Author: CERN DEM JLC; CreateDate: 03.12.2007; LatestRevisionDate: 13.03.2008
R5 R7 R9 R11 R21 R23 R25 R27 R37 R39 R41 R43 R53 R55 R57 R59 = R2512_470R_1%_1W_100PPM: Resistor - 1%; Part Description: Thick Film Chip Resistor; Manufacturer: GENERIC; Manufacturer1 Part Number: RC2512FK-07470RL; Power: 1W; TC: ±100ppm/°C; PressFit: No; Part Number: R2512_470R_1%_1W_100PPM; Component Kind: Standard; Component Type: Standard; Pin Count: 2; Value: 470; Status: Preferred; Manufacturer Part Number: R2512_470R_1%_1W_100PPM; Case: 2512; Mounted: Yes; Sense: No; Socket: No; SMD: Yes; Manufacturer1 Example: YAGEO PHYCOMP; Manufacturer1 ComponentHeight: 0.65mm; HelpURL: \\cern.ch\dfs\Applications\Altium\Datasheets\R2512_YAGEO_RC_L.pdf; Author: CERN DEM BC; CreateDate: 08.03.2021; LatestRevisionDate: 08.03.2021
R6 R8 R10 R12 R22 R24 R26 R28 R38 R40 R42 R44 R54 R56 R58 R60 = R0603_4K7_1%_0.1W_100PPM: as R68 on sheet Power; Part Number: R0603_4K7_1%_0.1W_100PPM; Component Kind: Standard; Component Type: Standard; Pin Count: 2; Value: 4k7; Status: Preferred; Manufacturer Part Number: R0603_4K7_1%_0.1W_100PPM; Case: 0603; Mounted: Yes; Sense: No; Socket: No; SMD: Yes; Manufacturer1 Example: NIC COMPONENT; Manufacturer1 ComponentHeight: 0.55mm; HelpURL: \\cern.ch\dfs\Applications\Altium\Datasheets\R0603_NIC_NRC.pdf; Author: CERN DEM JLC; CreateDate: 03.12.2007; LatestRevisionDate: 13.03.2008
T1-T16 = BC817: as T18 on sheet Power; Part Number: BC817; Component Kind: Standard; Component Type: Standard; Device: BC817; PackageDescription: SOT23, 0.95mm Pitch; 3 Pin, 1.30mm W X 2.90mm L X 1.10mm H body, IPC Medium Density; Manufacturer Part Number: BC817; Pin Count: 3; Case: SOT23-3; Mounted: Yes; Socket: No; SMD: Yes; Sense: No; ComponentHeight: 1.1mm; HelpURL: \\cern.ch\dfs\Applications\Altium\Datasheets\BC817.pdf; Author: CERN DEM JLC; CreateDate: 12.05.2011; LatestRevisionDate: 12.05.2011
Tp1-Tp24 = Test point: Published: 8-Jun-2000; LatestRevisionDate: 17-Jul-2002; LatestRevisionNote: Re-released for DXP Platform.; PackageReference: AXIAL-0.3; Publisher: Altium Limited

## Sheet FlashMemory.SchDoc
size A4; SheetNumber: 4; SheetTotal: 11
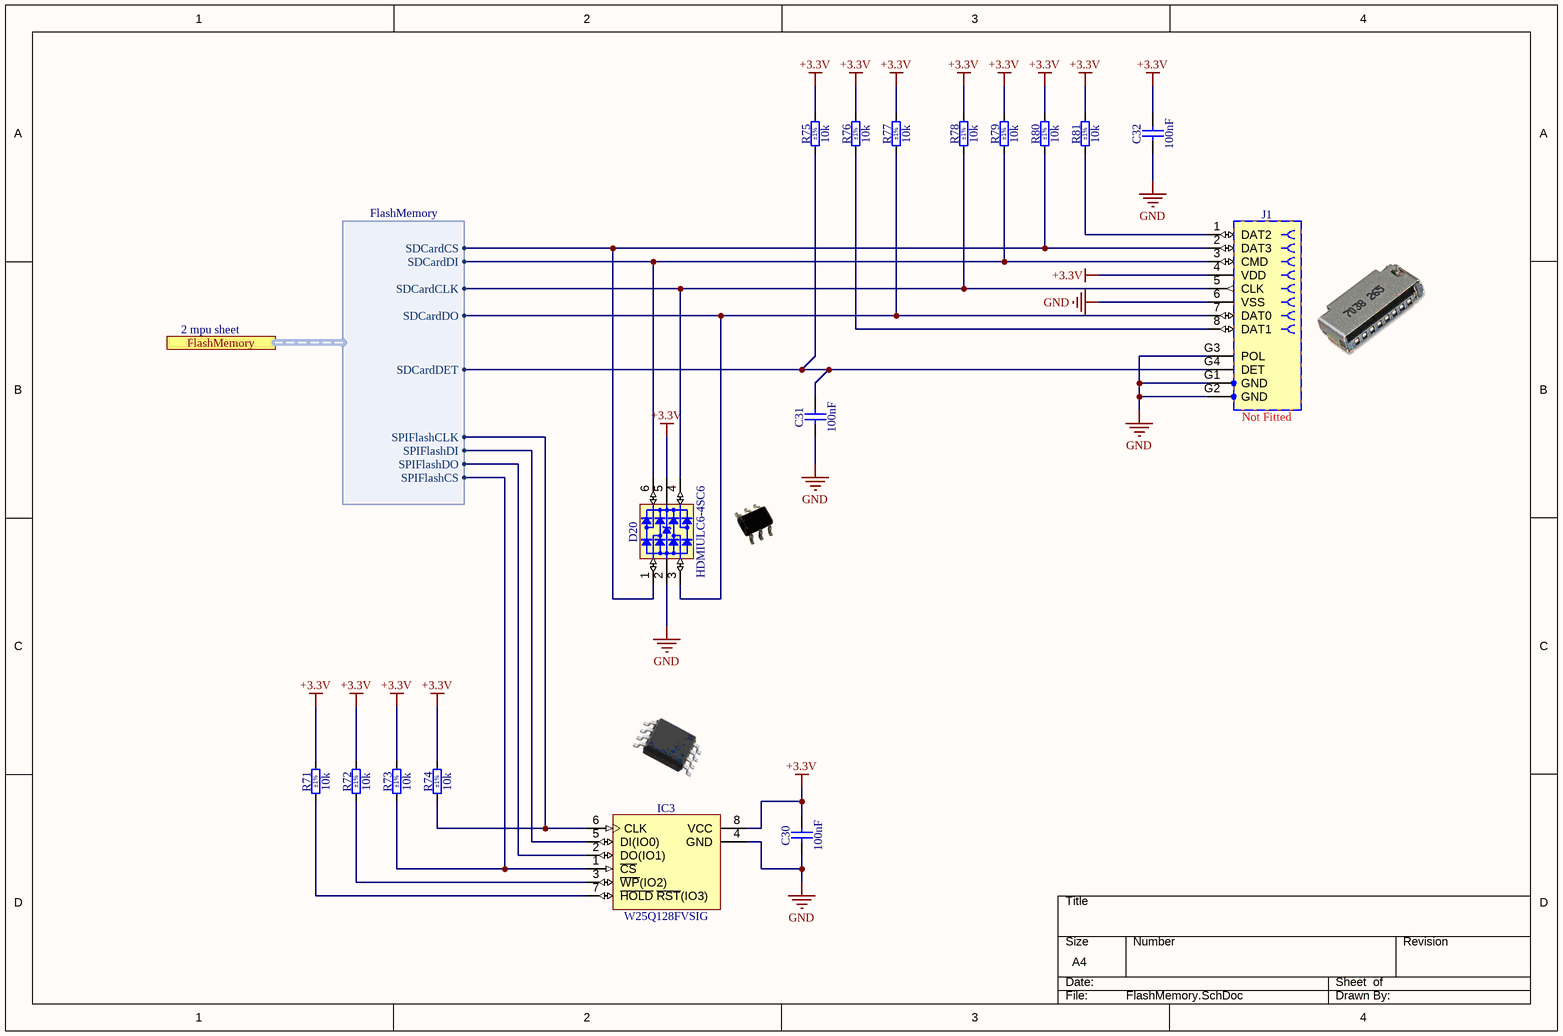
[diagram p2: FlashMemory.SchDoc]

### Parts
C30  100nF  [CAPC1608X87N]
C31  100nF  [CAPC1608X87N]
C32  100nF  [CAPC1608X87N]
D20  HDMIULC6-4SC6  [SOT95P280X145-6N]
IC3  W25Q128FVSIG  [SOIC127P790X216-8N]
J1  Not Fitted  [MOLEX_47309-2651]
R71  10k  Tolerance: ±1%  [RESC1608X55N]
R72  10k  Tolerance: ±1%  [RESC1608X55N]
R73  10k  Tolerance: ±1%  [RESC1608X55N]
R74  10k  Tolerance: ±1%  [RESC1608X55N]
R75  10k  Tolerance: ±1%  [RESC1608X55N]
R76  10k  Tolerance: ±1%  [RESC1608X55N]
R77  10k  Tolerance: ±1%  [RESC1608X55N]
R78  10k  Tolerance: ±1%  [RESC1608X55N]
R79  10k  Tolerance: ±1%  [RESC1608X55N]
R80  10k  Tolerance: ±1%  [RESC1608X55N]
R81  10k  Tolerance: ±1%  [RESC1608X55N]

### Ports
FlashMemory (harness FlashMemory)

### Harnesses
FlashMemory: SDCardDO, SDCardCLK, SDCardDI, SDCardCS, SPIFlashCS, SDCardDET, SPIFlashDO, SPIFlashDI, SPIFlashCLK

### Nets
+3.3V: C30.2 C32.2 D20.5(VBUS) IC3.8(VCC) J1.4(VDD) R71.2 R72.2 R73.2 R74.2 R75.2 R76.2 R77.2 R78.2 R79.2 R80.2 R81.2
GND: C30.1 C31.1 C32.1 D20.2(GND) IC3.4(GND) J1.6(VSS) J1.G1(GND) J1.G2(GND) J1.G3(POL)
SDCardCLK: D20.4(I/O3) J1.5(CLK) R78.1 ; port FlashMemory.SDCardCLK
SDCardCS: D20.1(I/O1) J1.2(DAT3) R80.1 ; port FlashMemory.SDCardCS
SDCardDET: C31.2 J1.G4(DET) R75.1 ; port FlashMemory.SDCardDET
SDCardDI: D20.6(I/O4) J1.3(CMD) R79.1 ; port FlashMemory.SDCardDI
SDCardDO: D20.3(I/O2) J1.7(DAT0) R77.1 ; port FlashMemory.SDCardDO
SPIFlashCLK: IC3.6(CLK) R74.1 ; port FlashMemory.SPIFlashCLK
SPIFlashCS: IC3.1(~{CS}) R73.1 ; port FlashMemory.SPIFlashCS
SPIFlashDI: IC3.5(DI(IO0)) ; port FlashMemory.SPIFlashDI
SPIFlashDO: IC3.2(DO(IO1)) ; port FlashMemory.SPIFlashDO
NetIC3_3: IC3.3(~{WP}(IO2)) R72.1
NetIC3_7: IC3.7(~{HOLD}_~{RST}(IO3)) R71.1
NetJ1_1: J1.1(DAT2) R81.1
NetJ1_8: J1.8(DAT1) R76.1

### Notes on the sheet
- 2 mpu sheet
- THIS DOCUMENT AND THE DATA DISCLOSED HEREIN OR
- HEREWITH IS THE PROPERTY OF ALTIUM LIMITED AND MAY
- DWG NO:
- REVISION
- REV:
- DESCRIPTION
- DATE
- APPROVED
- BE FREELY DISTRIBUTED IN WHOLE. NO RIGHTS ARE
- RESERVED OR EXPRESS OR IMPLIED WARANTEE GIVEN.
- ENG:
- APPROVALS
- PROJECT
- DSN:
- CHK:
- REFERENCE DOCUMENTS
- PROJECT REVISION:
- TITLE
- DOCUMENT REVISION:
- DESIGN ITEM:
- BOM:
- FAB DWG:
- PCB DWG:
- ASSY DWG:
- SCALE:
- A3
- SIZE
- CAGE CODE
- FILE NAME
- DWG NO.
- SHEET
- OF
- REV

### Library data of the parts
C30-C32 = CC0603_100NF_50V_10%_X7R: as C19 on sheet Power; Part Number: CC0603_100NF_50V_10%_X7R; Component Kind: Standard; Component Type: Standard; Pin Count: 2; Value: 100nF; Status: Preferred; Manufacturer Part Number: CC0603_100NF_50V_10%_X7R; Case: 0603; Mounted: Yes; Socket: No; SMD: Yes; Sense: No; Manufacturer1 Example: PHYCOMP; Manufacturer1 ComponentHeight: 0.87mm; HelpURL: \\cern.ch\dfs\Applications\Altium\Datasheets\CC0603_X7R_PHYCOMP.pdf; Author: CERN DEM JLC; CreateDate: 03.12.2007; LatestRevisionDate: 03.12.2007
D20 = HDMIULC6-4SC6: Ultra Large Bandwidth HDMI ESD Protection; Part Description: Ultra Large Bandwidth HDMI ESD (15kV) Protection; Manufacturer: ST MICROELECTRONICS; Voltage: 6V; PressFit: No; Bonding: No; Part Number: HDMIULC6-4SC6; Component Kind: Standard; Component Type: Standard; Device: HDMIULC6-4SC6; PackageDescription: SOT, 0.95mm Pitch; 6 Pin, 1.60mm W X 3.00mm L X 1.45mm H body, IPC Medium Density; Manufacturer Part Number: HDMIULC6-4SC6; Pin Count: 6; Case: SOT23-6; Mounted: Yes; Socket: No; SMD: Yes; Sense: No; ComponentHeight: 1.45mm; HelpURL: \\cern.ch\dfs\Applications\Altium\Datasheets\HDMIULC6-4SC6.pdf; Author: CERN DEM JLC; CreateDate: 04.06.2012; LatestRevisionDate: 03.07.2012
IC3 = W25Q128FVSIG: 128M-bit Serial Flash Memory with uniform 4KB sectors and Dual/Quad SPI and QPI; Manufacturer: WINBOND; PressFit: No; Bonding: No; Part Number: W25Q128FVSIG; Component Kind: Standard; Component Type: Standard; Device: W25Q128FVSIG; PackageDescription: SOIC, 1.27mm Pitch; 8 Pin, 5.285mm W X 5.335mm L X 2.16mm H body, IPC Medium Density; Part Description: 128M-bit Serial Flash Memory with uniform 4KB sectors and Dual/Quad SPI and QPI; Manufacturer Part Number: W25Q128FVSIG; Pin Count: 8; Case: SOIC8; Mounted: Yes; Socket: No; SMD: Yes; Sense: No; ComponentHeight: 2.16mm; HelpURL: \\cern.ch\dfs\Applications\Altium\Datasheets\W25Q128FVSIG.pdf; Author: CERN DEM MR; CreateDate: 26.01.2018; LatestRevisionDate: 26.01.2018
J1 = MOLEX_47309-2651: MicroSD Card Header with Detect Switch; Part Description: 1.10mm Pitch microSD Card Header with Detect Switch; Manufacturer: MOLEX; PressFit: No; Part Number: MOLEX_47309-2651; Component Kind: Standard; Component Type: Standard; Pin Count: 12; Family: microSD; Mounted: Yes; Socket: No; SMD: Yes; Sense: No; Status: None; Manufacturer Part Number: 47309-2651; ComponentHeight: 2.65mm; HelpURL: \\cern.ch\dfs\Applications\Altium\Datasheets\MOLEX_47309-2651.pdf; Author: CERN DEM JMW; CreateDate: 29.06.2017; LatestRevisionDate: 29.06.2017
R71-R81 = R0603_10K_1%_0.1W_100PPM: Resistor - 1%; Part Description: General Purpose Thick Film Chip Resistor; Manufacturer: GENERIC; Manufacturer1 Part Number: NRC06F1002TRF; Power: 0.1W; TC: ±100ppm/°C; PressFit: No; Part Number: R0603_10K_1%_0.1W_100PPM; Component Kind: Standard; Component Type: Standard; Pin Count: 2; Value: 10k; Status: Preferred; Manufacturer Part Number: R0603_10K_1%_0.1W_100PPM; Case: 0603; Mounted: Yes; Sense: No; Socket: No; SMD: Yes; Manufacturer1 Example: NIC COMPONENT; Manufacturer1 ComponentHeight: 0.55mm; HelpURL: \\cern.ch\dfs\Applications\Altium\Datasheets\R0603_NIC_NRC.pdf; Author: CERN DEM JLC; CreateDate: 03.12.2007; LatestRevisionDate: 13.03.2008

## Sheet mcu.SchDoc
size A3; SheetNumber: 5; SheetTotal: 11
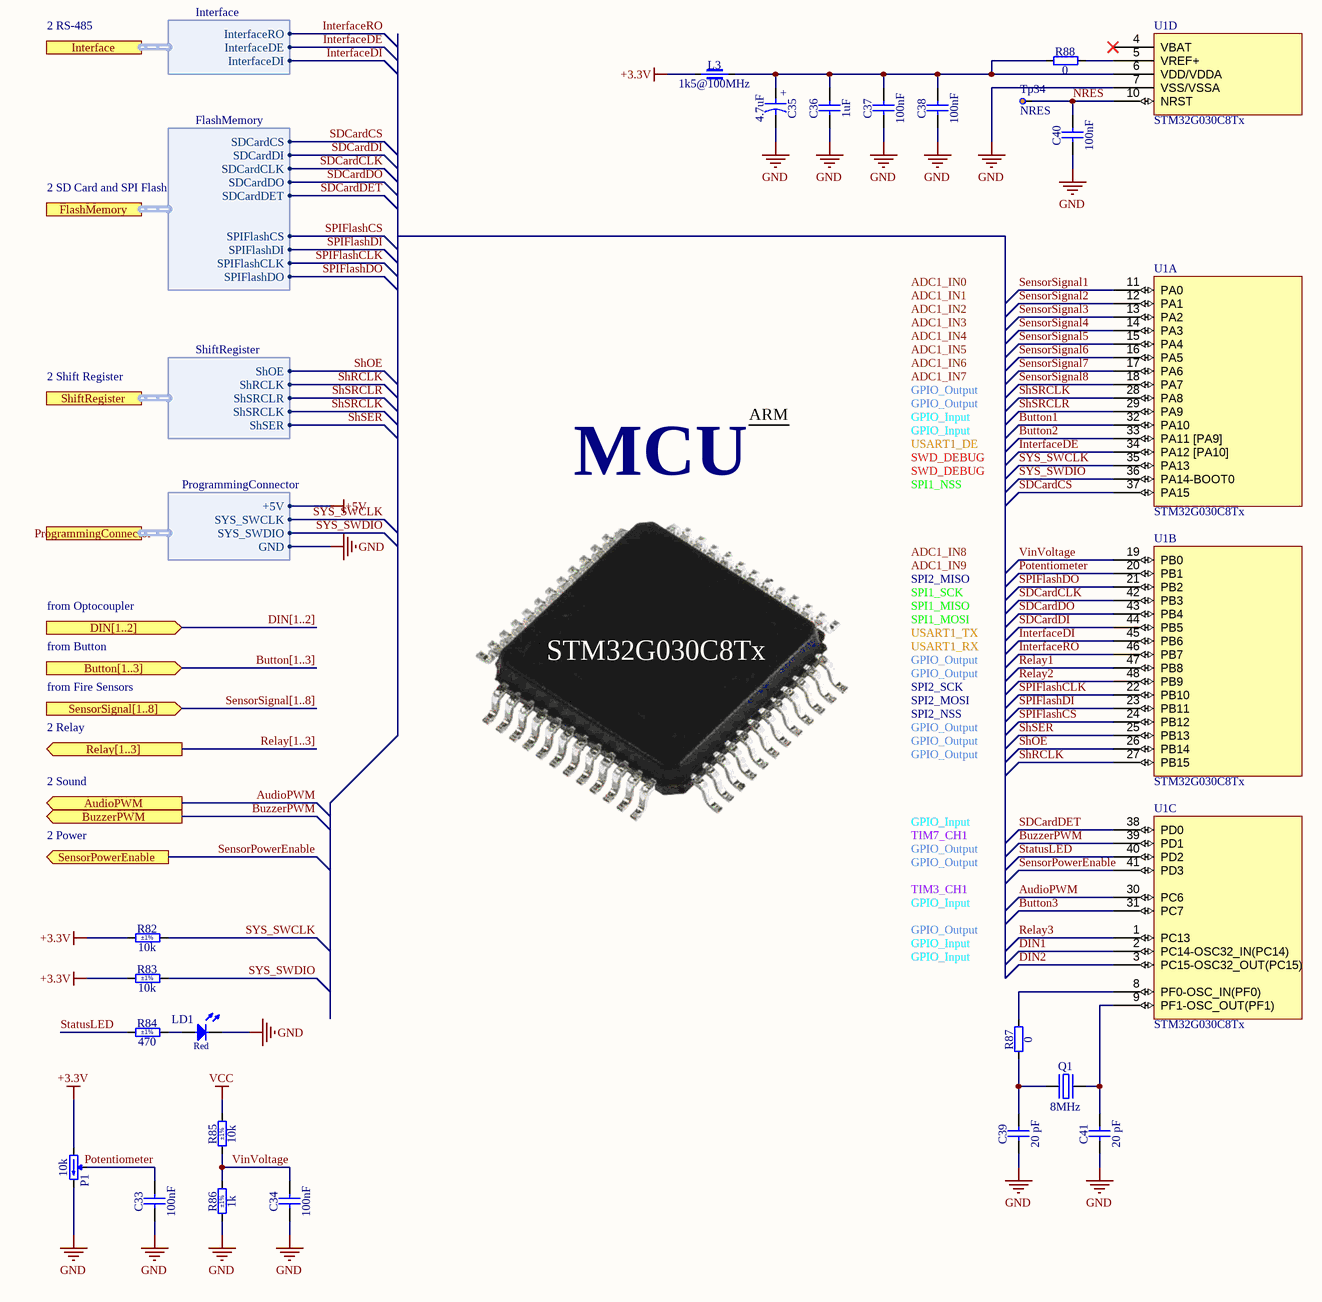
[diagram p3: mcu.SchDoc]

### Parts
C33  100nF  [CAPC1608X87N]
C34  100nF  [CAPC1608X87N]
C35  4.7uF  [CAPMP3216X180N]
C36  1uF  [CAPC1608X87N]
C37  100nF  [CAPC1608X87N]
C38  100nF  [CAPC1608X87N]
C39  20 pF  [CAPC1608X90N]
C40  100nF  [CAPC1608X87N]
C41  20 pF  [CAPC1608X90N]
L3  1k5@100MHz  [INDC2012X110N]
LD1  Red  [LED_AVAGO_HSMH-C150]
P1  10k  [TRIM_BOURNS_3296W]
Q1  8MHz  [XTAL_TXC_7A]
R82  10k  Tolerance: ±1%  [RESC1608X55N]
R83  10k  Tolerance: ±1%  [RESC1608X55N]
R84  470  Tolerance: ±1%  [RESC1608X55N]
R85  10k  Tolerance: ±1%  [RESC1608X55N]
R86  1k  Tolerance: ±1%  [RESC1608X55N]
R87  0  [RESC1608X55N]
R88  0  [RESC1608X55N]
Tp34  NRES  [TP_C40]
U1  STM32G030C8Tx  [ST LQFP-48 7x7MM]  (parts A,B,C,D of 4)

### Ports
AudioPWM (out), Button[1..3] (in), BuzzerPWM (out), DIN[1..2] (in), FlashMemory (harness FlashMemory), Interface (harness Interface), ProgrammingConnector (harness ProgrammingConnector), Relay[1..3] (out), SensorPowerEnable (out), SensorSignal[1..8] (in), ShiftRegister (harness ShiftRegister)

### Harnesses
Interface: InterfaceRO, InterfaceDE, InterfaceDI
FlashMemory: SDCardDO, SDCardCLK, SDCardDI, SDCardCS, SPIFlashCS, SDCardDET, SPIFlashDO, SPIFlashDI, SPIFlashCLK
ShiftRegister: ShOE, ShRCLK, ShSRCLR, ShSRCLK, ShSER
ProgrammingConnector: +5V, SYS_SWCLK, SYS_SWDIO, GND

### Nets
+3.3V: L3.1 P1.1(CCW) R82.1 R83.1
GND: C33.1 C34.1 C35.2 C36.1 C37.1 C38.1 C39.1 C40.1 C41.1 LD1.1(C) P1.3(CW) R86.1 U1.7(VSS/VSSA) ; port ProgrammingConnector.GND
VCC: R85.2
AudioPWM: U1.30(PC6) ; port AudioPWM
Button1: U1.32(PA10)
Button2: U1.33(PA11_[PA9])
Button3: U1.31(PC7)
BuzzerPWM: U1.39(PD1) ; port BuzzerPWM
DIN1: U1.2(PC14-OSC32_IN(PC14))
DIN2: U1.3(PC15-OSC32_OUT(PC15))
InterfaceDE: U1.34(PA12_[PA10]) ; port Interface.InterfaceDE
InterfaceDI: U1.45(PB6) ; port Interface.InterfaceDI
InterfaceRO: U1.46(PB7) ; port Interface.InterfaceRO
NRES: C40.2 Tp34.1 U1.10(NRST)
Potentiometer: C33.2 P1.2(W) U1.20(PB1)
Relay1: U1.47(PB8)
Relay2: U1.48(PB9)
Relay3: U1.1(PC13)
SDCardCLK: U1.42(PB3) ; port FlashMemory.SDCardCLK
SDCardCS: U1.37(PA15) ; port FlashMemory.SDCardCS
SDCardDET: U1.38(PD0) ; port FlashMemory.SDCardDET
SDCardDI: U1.44(PB5) ; port FlashMemory.SDCardDI
SDCardDO: U1.43(PB4) ; port FlashMemory.SDCardDO
SensorPowerEnable: U1.41(PD3) ; port SensorPowerEnable
SensorSignal1: U1.11(PA0)
SensorSignal2: U1.12(PA1)
SensorSignal3: U1.13(PA2)
SensorSignal4: U1.14(PA3)
SensorSignal5: U1.15(PA4)
SensorSignal6: U1.16(PA5)
SensorSignal7: U1.17(PA6)
SensorSignal8: U1.18(PA7)
ShOE: U1.26(PB14) ; port ShiftRegister.ShOE
ShRCLK: U1.27(PB15) ; port ShiftRegister.ShRCLK
ShSER: U1.25(PB13) ; port ShiftRegister.ShSER
ShSRCLK: U1.28(PA8) ; port ShiftRegister.ShSRCLK
ShSRCLR: U1.29(PA9) ; port ShiftRegister.ShSRCLR
SPIFlashCLK: U1.22(PB10) ; port FlashMemory.SPIFlashCLK
SPIFlashCS: U1.24(PB12) ; port FlashMemory.SPIFlashCS
SPIFlashDI: U1.23(PB11) ; port FlashMemory.SPIFlashDI
SPIFlashDO: U1.21(PB2) ; port FlashMemory.SPIFlashDO
StatusLED: R84.1 U1.40(PD2)
SYS_SWCLK: R82.2 U1.35(PA13) ; port ProgrammingConnector.SYS_SWCLK
SYS_SWDIO: R83.2 U1.36(PA14-BOOT0) ; port ProgrammingConnector.SYS_SWDIO
VinVoltage: C34.2 R85.1 R86.2 U1.19(PB0)
NetC35_1: C35.1 C36.2 C37.2 C38.2 L3.2 R88.1 U1.6(VDD/VDDA)
NetC39_2: C39.2 Q1.1(OSC1) R87.1
NetC41_2: C41.2 Q1.2(OSC2) U1.9(PF1-OSC_OUT(PF1))
NetLD1_2: LD1.2(A) R84.2
NetR87_2: R87.2 U1.8(PF0-OSC_IN(PF0))
NetR88_2: R88.2 U1.5(VREF+)

Not connected (* = marked no-connect by the designer): U1 4(VBAT)*

### Buses and harness runs
bus Button[1..3] = port Button[1..3]
bus DIN[1..2] = port DIN[1..2]
bus Relay[1..3] = port Relay[1..3]
bus SensorSignal[1..8] = port SensorSignal[1..8]

### Notes on the sheet
- 2 RS-485
- 2 SD Card and SPI Flash
- ADC1_IN0
- ADC1_IN1
- ADC1_IN2
- ADC1_IN3
- ADC1_IN4
- 2 Shift Register
- ADC1_IN5
- ADC1_IN6
- ADC1_IN7
- GPIO_Output
- ARM
- USART1_DE
- SWD_DEBUG
- GPIO_Input
- MCU
- SPI1_NSS
- from Optocoupler
- ADC1_IN8
- ADC1_IN9
- SPI2_MISO
- SPI1_MISO
- SPI1_SCK
- from Button
- STM32G030C8Tx
- USART1_RX
- USART1_TX
- SPI1_MOSI
- from Fire Sensors
- 2 Relay
- SPI2_SCK
- SPI2_MOSI
- SPI2_NSS
- 2 Sound
- 2 Power
- TIM7_CH1
- TIM3_CH1
- THIS DOCUMENT AND THE DATA DISCLOSED HEREIN OR
- HEREWITH IS THE PROPERTY OF ALTIUM LIMITED AND MAY
- DWG NO:
- REVISION
- REV:
- DESCRIPTION
- DATE
- APPROVED
- BE FREELY DISTRIBUTED IN WHOLE. NO RIGHTS ARE
- RESERVED OR EXPRESS OR IMPLIED WARANTEE GIVEN.
- ENG:
- APPROVALS
- PROJECT
- DSN:
- CHK:
- REFERENCE DOCUMENTS
- PROJECT REVISION:
- TITLE
- DOCUMENT REVISION:
- DESIGN ITEM:
- BOM:
- FAB DWG:
- PCB DWG:
- ASSY DWG:
- SCALE:
- A3
- SIZE
- CAGE CODE
- FILE NAME
- DWG NO.
- SHEET
- OF
- REV
- (in symbol CTE3216-18_4.7UF_10V_10%_AVX_TPSA475K010T1400) +

### Library data of the parts
C33 C34 C37 C38 C40 = CC0603_100NF_50V_10%_X7R: as C19 on sheet Power; Part Number: CC0603_100NF_50V_10%_X7R; Component Kind: Standard; Component Type: Standard; Pin Count: 2; Value: 100nF; Status: Preferred; Manufacturer Part Number: CC0603_100NF_50V_10%_X7R; Case: 0603; Mounted: Yes; Socket: No; SMD: Yes; Sense: No; Manufacturer1 Example: PHYCOMP; Manufacturer1 ComponentHeight: 0.87mm; HelpURL: \\cern.ch\dfs\Applications\Altium\Datasheets\CC0603_X7R_PHYCOMP.pdf; Author: CERN DEM JLC; CreateDate: 03.12.2007; LatestRevisionDate: 03.12.2007
C35 = CTE3216-18_4.7UF_10V_10%_AVX_TPSA475K010T1400: Polarised capacitor; Part Description: Low ESR 1R4 Automotive Solid Tantalum Chip Capacitor; Manufacturer: AVX; Voltage: 10V; Tolerance: ±10%; Part Number: CTE3216-18_4.7UF_10V_10%_AVX_TPSA475K010T1400; Component Kind: Standard; Component Type: Standard; Pin Count: 2; Value: 4.7uF; Status: Preferred; Manufacturer Part Number: TPSA475K010T1400; Case: A; Mounted: Yes; Socket: No; SMD: Yes; Sense: No; ComponentHeight: 1.8mm; HelpURL: \\cern.ch\dfs\Applications\Altium\Datasheets\CTE-LESR_AVX_TPS-AUTO.pdf; Author: CERN DEM JLC; CreateDate: 23.01.2018; LatestRevisionDate: 23.01.2018
C36 = CC0603_1UF_16V_10%_X7R: Non-polarised capacitor; Part Description: SMD Multilayer Chip Ceramic Capacitor; Manufacturer: GENERIC; Manufacturer1 Part Number: 223878615663; Voltage: 16V; TC: X7R; Tolerance: ±10%; Part Number: CC0603_1UF_16V_10%_X7R; Component Kind: Standard; Component Type: Standard; Pin Count: 2; Value: 1uF; Status: None; Manufacturer Part Number: CC0603_1UF_16V_10%_X7R; Case: 0603; Mounted: Yes; Socket: No; SMD: Yes; Sense: No; Manufacturer1 Example: YAGEO PHYCOMP; Manufacturer1 ComponentHeight: 0.9mm; HelpURL: \\cern.ch\dfs\Applications\Altium\Datasheets\CC0603_X7R_PHYCOMP.pdf; Author: CERN DEM JLC; CreateDate: 03.12.2007; LatestRevisionDate: 17.04.2015
C39 C41 = CC0603_20PF_50V_5%_NP0: Non-polarised capacitor; Part Description: SMD Multilayer Chip Ceramic Capacitor; Manufacturer: GENERIC; Manufacturer1 Part Number: CC0603JRNPO9BN200; Voltage: 50V; TC: C0G/NP0; Tolerance: ±5 %; Part Number: CC0603_20PF_50V_5%_NP0; Component Kind: Standard; Component Type: Standard; Pin Count: 2; Value: 20 pF; Status: Preferred; Manufacturer Part Number: CC0603_20PF_50V_5%_NP0; Case: 0603; Mounted: Yes; Socket: No; SMD: Yes; Sense: No; Manufacturer1 Example: YAGEO PHYCOMP; Manufacturer1 ComponentHeight: 0.9 mm; HelpURL: \\cern.ch\dfs\Applications\Altium\Datasheets\CC0603_NPO_YAGEO.pdf; Author: CERN DEM JMW; CreateDate: 27.07.2021; LatestRevisionDate: 27.07.2021
L3 = IND0805_WURTH_742792097: Part Description: SMD EMI Suppression Chip Ferrite Bead (WE-CBF Series); Manufacturer: WURTH ELEKTRONIK; Power: 1A; Resistance: 0.3R; Tolerance: ±25%; Part Number: IND0805_WURTH_742792097; Component Kind: Standard; Component Type: Standard; Pin Count: 2; Value: 1k5@100MHz; Manufacturer Part Number: 742792097; Case: 0805; Mounted: Yes; Socket: No; SMD: Yes; Sense: No; ComponentHeight: 1.1mm; HelpURL: \\cern.ch\dfs\Applications\Altium\Datasheets\IND0805_WURTH_742792097.pdf; Author: CERN DEM MR; CreateDate: 29.06.2017; LatestRevisionDate: 25.10.2018
LD1 = LED_AVAGO_HSMH-C150: LED Red 1C 2A; Part Description: Red Diffused Surface Mount LED (1206 Case); Manufacturer: AVAGO TECHNOLOGIES; PressFit: No; Bonding: No; Part Number: LED_AVAGO_HSMH-C150; Component Kind: Standard; Component Type: Standard; Color: Red; PackageDescription: Red Diffused Chip LED, 2-Leads, Body 3.2 x1.6mm, IPC Medium Density; Manufacturer Part Number: HSMH-C150; Pin Count: 2; Case: 1206; Mounted: Yes; Socket: No; SMD: Yes; Sense: No; ComponentHeight: 1.2mm; HelpURL: \\cern.ch\dfs\Applications\Altium\Datasheets\LED_AVAGO_HSMH-C150.pdf; Author: CERN DEM JLC; CreateDate: 08.03.2018; LatestRevisionDate: 08.03.2018
P1 = TRIM_25T_10K_BOURNS_3296W-1-103LF: Trimming Potentiometer; Part Description: 25 Turn Trimming Potentiometer (Top Adjustment); Manufacturer: BOURNS; Power: 0.5W; TC: ±100ppm/°C; Tolerance: ±10%; PressFit: No; Part Number: TRIM_25T_10K_BOURNS_3296W-1-103LF; Component Kind: Standard; Component Type: Standard; Pin Count: 3; Value: 10k; Manufacturer Part Number: 3296W-1-103LF; Case: 3296W; Mounted: Yes; Socket: No; SMD: No; Sense: No; ComponentHeight: 11.55mm; HelpURL: \\cern.ch\dfs\Applications\Altium\Datasheets\TRIM_BOURNS_3296W.pdf; Author: CERN DEM BC; CreateDate: 02.11.2021; LatestRevisionDate: 02.11.2021
Q1 = XTAL_8MHZ_TXC_7A-8.000MAAE-T: Quartz Crystal; Part Description: Tolerance: ± 30ppm, Stability: ±30ppm, -20°C to +70°C, 12pF, SMD Glass Seam Sealing Crystal, 7A Series; Manufacturer: TXC CORPORATION; PressFit: No; Bonding: No; Part Number: XTAL_8MHZ_TXC_7A-8.000MAAE-T; Component Kind: Standard; Component Type: Standard; PackageDescription: SMD Glass Seam Sealing Crystal, 2 Pins, 3.20mm L X 5.00mm W, 7A Serie; Value: 8MHz; Manufacturer Part Number: 7A-8.000MAAE-T; Pin Count: 2; Mounted: Yes; Socket: No; SMD: Yes; Sense: No; ComponentHeight: 1.2mm; HelpURL: \\cern.ch\dfs\Applications\Altium\Datasheets\XTAL_TXC_7A.pdf; Author: CERN DEM JLC; CreateDate: 09.10.2014; LatestRevisionDate: 12.11.2014
R82 R83 R85 = R0603_10K_1%_0.1W_100PPM: as R71 on sheet FlashMemory; Part Number: R0603_10K_1%_0.1W_100PPM; Component Kind: Standard; Component Type: Standard; Pin Count: 2; Value: 10k; Status: Preferred; Manufacturer Part Number: R0603_10K_1%_0.1W_100PPM; Case: 0603; Mounted: Yes; Sense: No; Socket: No; SMD: Yes; Manufacturer1 Example: NIC COMPONENT; Manufacturer1 ComponentHeight: 0.55mm; HelpURL: \\cern.ch\dfs\Applications\Altium\Datasheets\R0603_NIC_NRC.pdf; Author: CERN DEM JLC; CreateDate: 03.12.2007; LatestRevisionDate: 13.03.2008
R84 = R0603_470R_1%_0.1W_100PPM: Resistor - 1%; Part Description: General Purpose Thick Film Chip Resistor; Manufacturer: GENERIC; Manufacturer1 Part Number: NRC06F4700TRF; Power: 0.1W; TC: ±100ppm/°C; PressFit: No; Part Number: R0603_470R_1%_0.1W_100PPM; Component Kind: Standard; Component Type: Standard; Pin Count: 2; Value: 470; Status: Preferred; Manufacturer Part Number: R0603_470R_1%_0.1W_100PPM; Case: 0603; Mounted: Yes; Sense: No; Socket: No; SMD: Yes; Manufacturer1 Example: NIC COMPONENT; Manufacturer1 ComponentHeight: 0.55mm; HelpURL: \\cern.ch\dfs\Applications\Altium\Datasheets\R0603_NIC_NRC.pdf; Author: CERN DEM JLC; CreateDate: 03.12.2007; LatestRevisionDate: 13.03.2008
R86 = R0603_1K_1%_0.1W_100PPM: as R67 on sheet Power; Part Number: R0603_1K_1%_0.1W_100PPM; Component Kind: Standard; Component Type: Standard; Pin Count: 2; Value: 1k; Status: Preferred; Manufacturer Part Number: R0603_1K_1%_0.1W_100PPM; Case: 0603; Mounted: Yes; Sense: No; Socket: No; SMD: Yes; Manufacturer1 Example: NIC COMPONENT; Manufacturer1 ComponentHeight: 0.55mm; HelpURL: \\cern.ch\dfs\Applications\Altium\Datasheets\R0603_NIC_NRC.pdf; Author: CERN DEM JLC; CreateDate: 03.12.2007; LatestRevisionDate: 13.03.2008
R87 R88 = R0603_0R_JUMPER: as R66 on sheet Power; Part Number: R0603_0R_JUMPER; Component Kind: Standard; Component Type: Standard; Pin Count: 2; Value: 0; Status: Preferred; Manufacturer Part Number: R0603_0R_JUMPER; Case: 0603; Mounted: Yes; Sense: No; Socket: No; SMD: Yes; Manufacturer1 Example: NIC COMPONENT; Manufacturer1 ComponentHeight: 0.55mm; HelpURL: \\cern.ch\dfs\Applications\Altium\Datasheets\R0603_NIC_NRC.pdf; Author: CERN DEM JLC; CreateDate: 03.12.2007; LatestRevisionDate: 13.03.2008
Tp34 = Test point: Published: 8-Jun-2000; LatestRevisionDate: 17-Jul-2002; LatestRevisionNote: Re-released for DXP Platform.; PackageReference: AXIAL-0.3; Publisher: Altium Limited
U1 = STM32G030C8Tx: ARM Microcontrollers - MCU Mainstream Value-Line Arm Cortex-M0+ MCU 64 Kbytes of Flash 8 Kbytes RAM, 64 MHz, LQFP48